# EAGLE schematic led_controller (EAGLE 7.5.0)
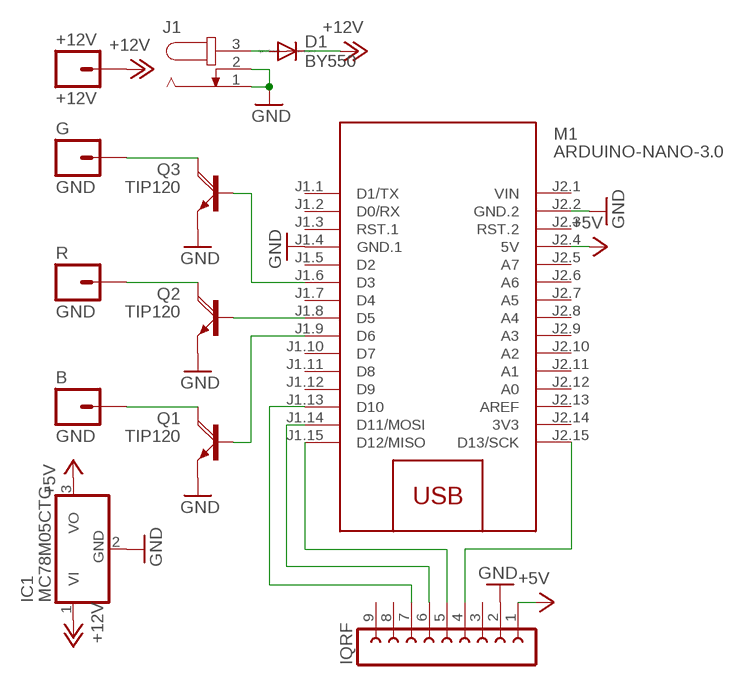
[diagram p0: schematic, sheet 1]

## Parts
+12V  +12V  M01PTH  [1X01]
B  GND  M01PTH  [1X01]
D1  BY550  [DO27-15]
G  GND  M01PTH  [1X01]
IC1  MC78M05CTG  7805T  [TO220H]
IQRF  FE09-1  [FE09]
J1  JACK-PLUG1  [SPC4078]
M1  ARDUINO-NANO-3.0  [ARDUINO-NANO-3.0]
Q1  TIP120  [TO220AH]
Q2  TIP120  [TO220AH]
Q3  TIP120  [TO220AH]
R  GND  M01PTH  [1X01]

## Nets
+5V: IC1.3(VO) IQRF.1 M1.J2.4(5V)
+12V [3apm]: +12V.1 D1.C IC1.1(VI)
GND: IC1.2(GND) IQRF.2 J1.1 J1.2 M1.J1.4(GND.1) M1.J2.2(GND.2) Q1.E Q2.E Q3.E
N$1: M1.J1.9(D6) Q1.B
N$2: M1.J1.8(D5) Q2.B
N$3: M1.J1.6(D3) Q3.B
N$4: IQRF.4 M1.J2.15(D13/SCK)
N$5: IQRF.5 M1.J1.15(D12/MISO)
N$6: IQRF.6 M1.J1.14(D11/MOSI)
N$7: IQRF.7 M1.J1.13(D10)
N$8: B.1 Q1.C
N$9: Q2.C R.1
N$10: G.1 Q3.C
N$11 [3apm]: D1.A J1.3
Unconnected: IQRF.3 IQRF.8 IQRF.9 M1.J1.1(D1/TX) M1.J1.2(D0/RX) M1.J1.3(RST.1) M1.J1.5(D2) M1.J1.7(D4) M1.J1.10(D7) M1.J1.11(D8) M1.J1.12(D9) M1.J2.3(RST.2) M1.J2.5(A7) M1.J2.6(A6) M1.J2.7(A5) M1.J2.8(A4) M1.J2.9(A3) M1.J2.10(A2) M1.J2.11(A1) M1.J2.12(A0) M1.J2.13(AREF)

## Power pins joined to a net without a drawn wire
3V3: M1.J2.14(3V3)
VIN: M1.J2.1(VIN)

## Library data of the parts
+12V B G R = SparkFun-Connectors:M01: Header 1 Standard 1-pin 0.1" header. Use with straight break away headers (SKU : PRT-00116), right angle break away headers (PRT-00553), swiss pins (PRT-00743), machine pins (PRT-00117), and female headers (PRT-00115). SMTSO-256-ET is a "flush mount" nut for a 4-40 screw. The older package used to be too tight, and did not allow it to sit properly thru the drill hit. The latest (0.165DIA) fits nice and snug.
D1 = diode:BY550: DIODE Si200 V, 5 A
IC1 = linear:78*: Positive VOLTAGE REGULATOR Source: http://cache.national.com/ds/LM/LM78L05.pdf http://www.fairchildsemi.com/ds/LM/LM7805.pdf
IQRF = con-lsta:FE09-1: FEMALE HEADER; OC_FARNELL: unknown; OC_NEWARK: unknown
J1 = con-jack:JACK-PLUG: DC POWER JACK Power Jack, DC, Right Angle, Through Hole, Rated 5A at 16VDC, PC Terminals Distributor: Farnell (www.Farnell.de) Drawing: 84N1161.pdf / 84N1162.pdf Manufacturer: SPC Technology (www.spctechnology.com) Type: SPC4077 / SPC 4078; OC_FARNELL: unknown; OC_NEWARK: unknown
M1 = diy-modules:ARDUINO-NANO-3.0: Arduino Nano 3.0
Q1-Q3 = transistor-power:TIP120: NPN DARLINGTON TRANSISTOR

## Net classes
1 3apm: width 2.54 mm